# EAGLE board BEP32_12nutzen (EAGLE 6.4), part 1 of 8
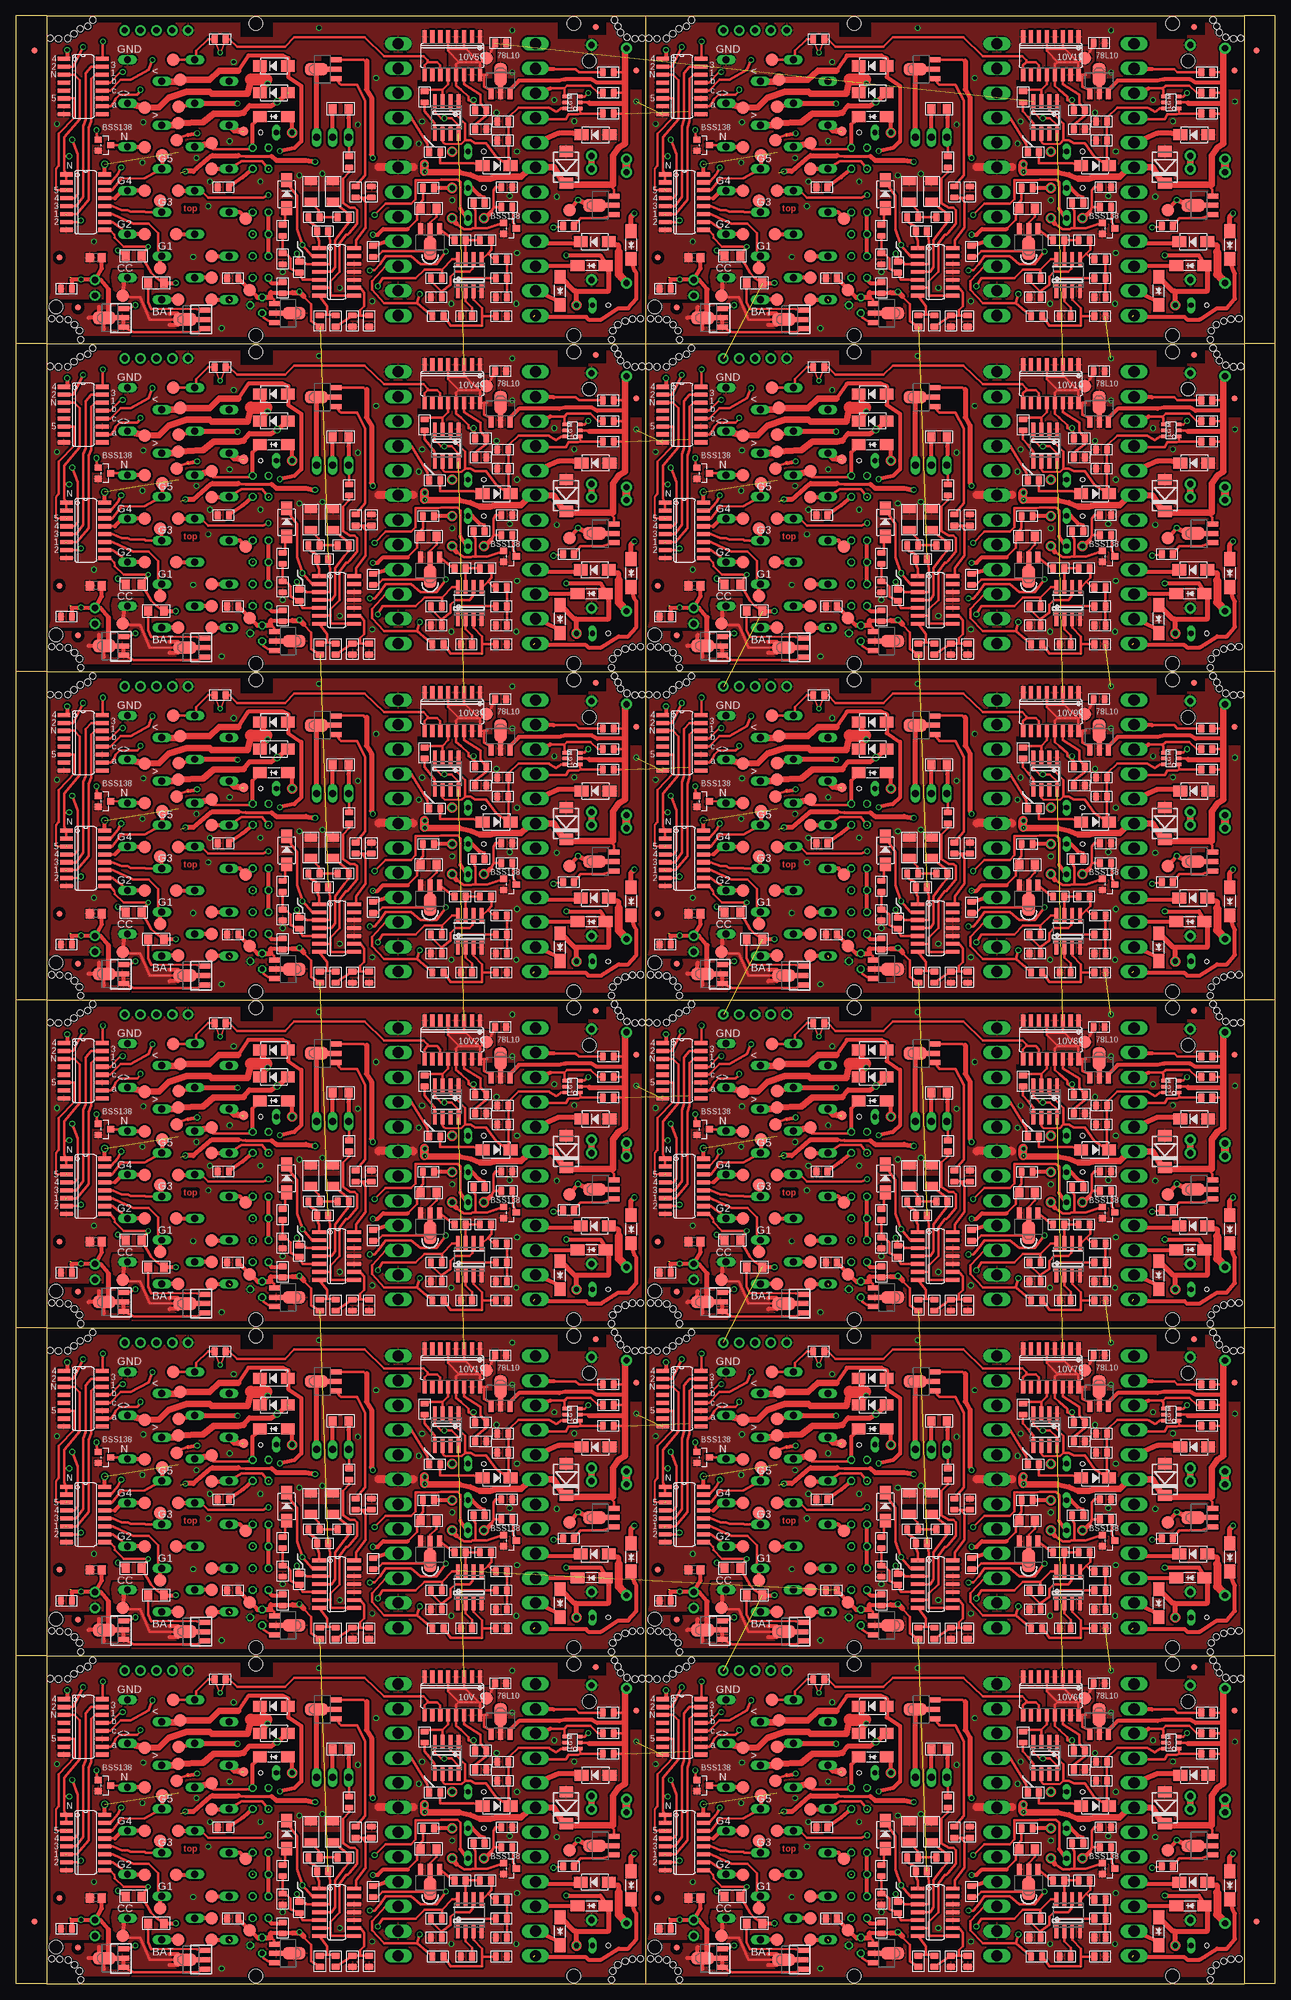
[diagram p24: board, top side]
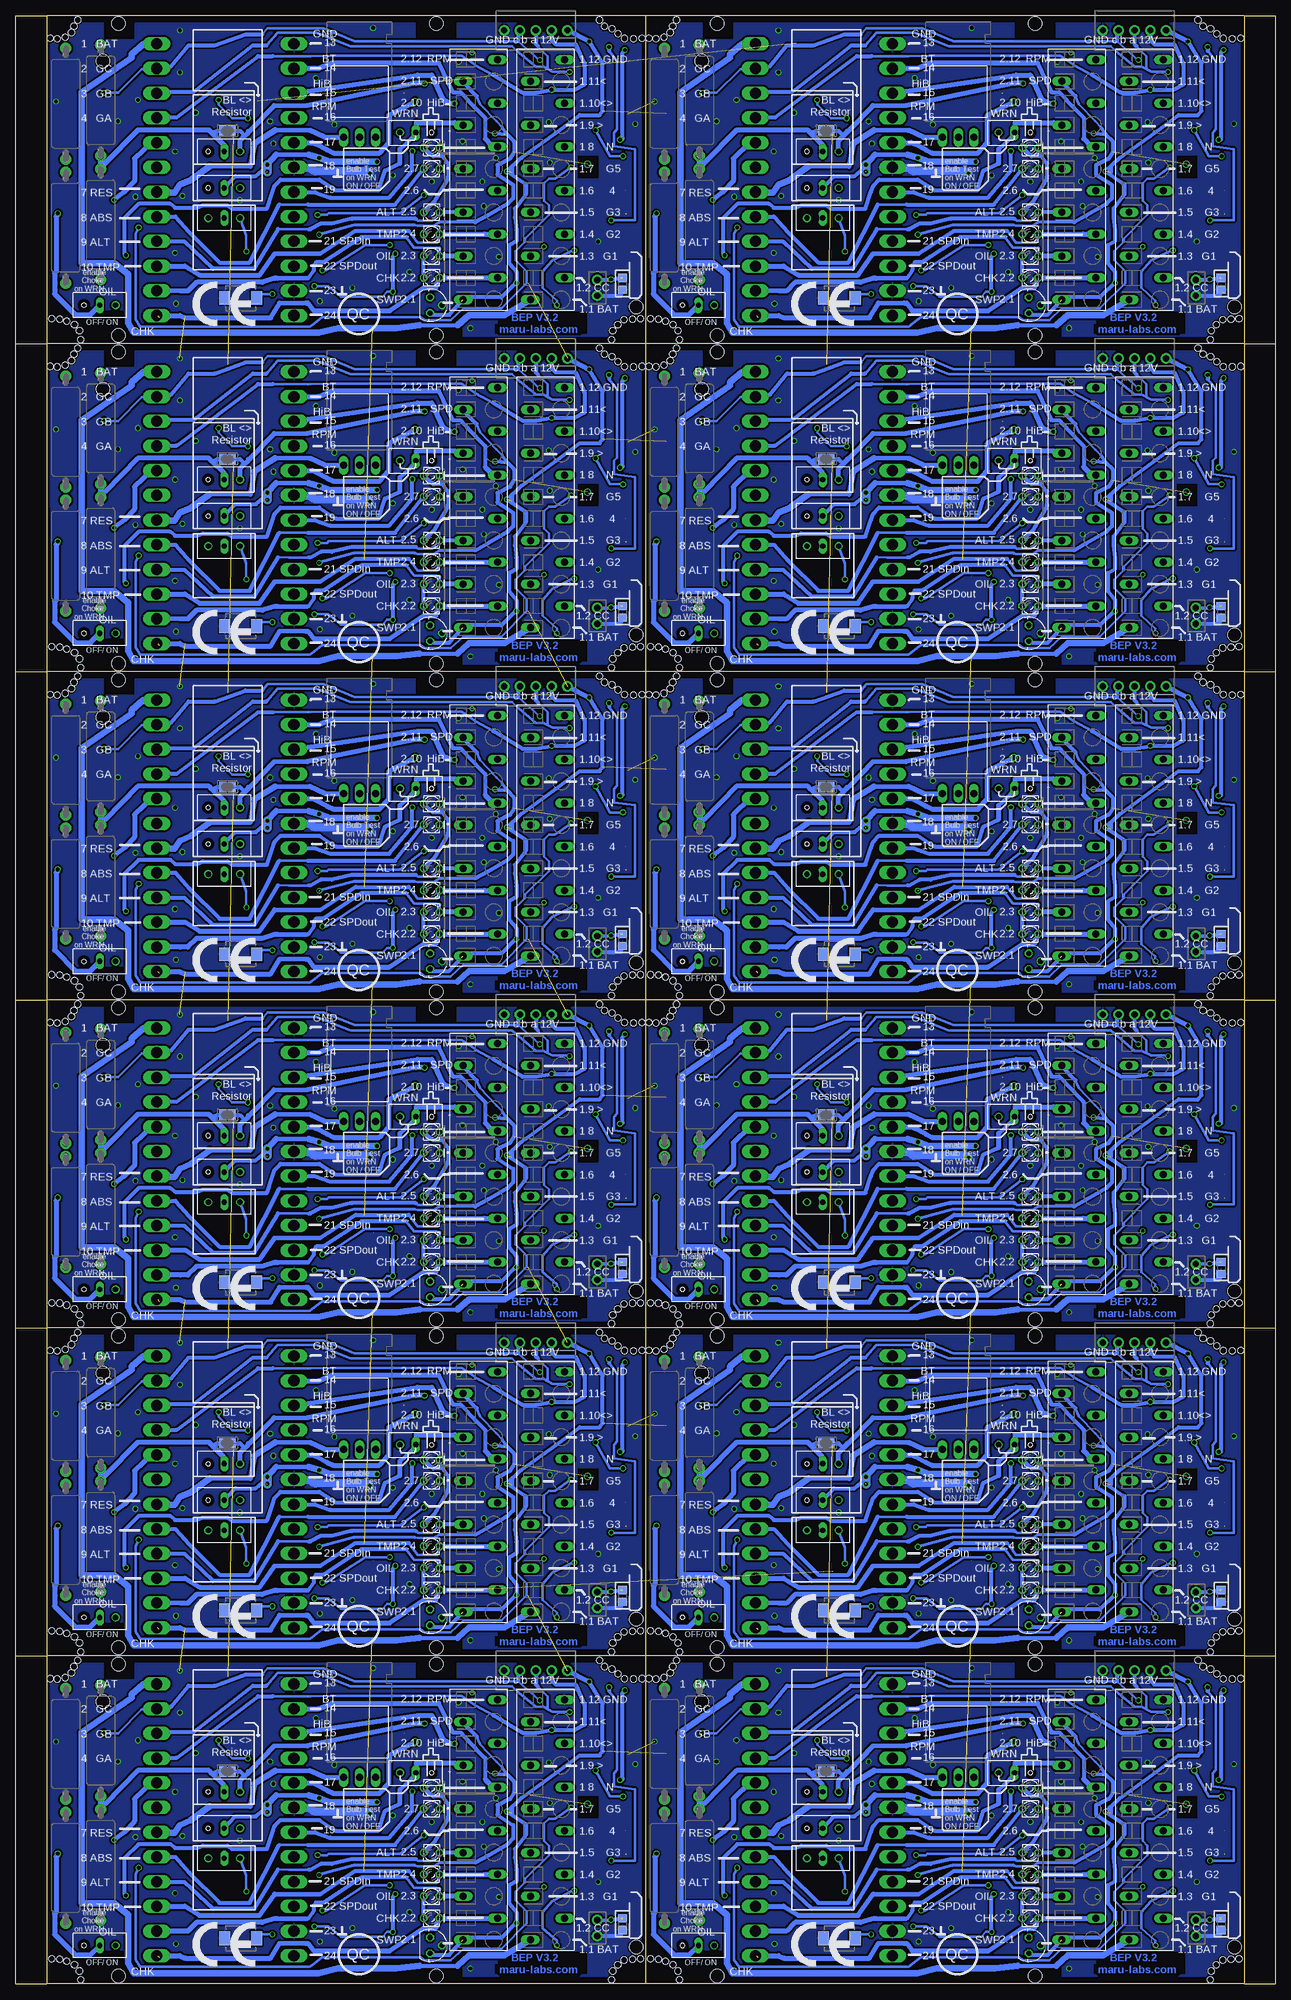
[diagram p25: board, bottom side, seen from below]

Size 202 x 315.6 mm. Coordinates in mm from the lower left corner, seen from the top.
Outline: 58 segments
Copper layers (1*16): Top 0.035mm / dielectric 1.5mm / Bottom 0.035mm
Design rules "multi-cb_035um-cu *": minimum track width 6mil, minimum drill 12mil, track to track 12mil, track to pad 12mil, pad to pad 6mil, via to via 6mil, smd to smd 6mil, copper to edge 10mil, drill to drill 8mil, minimum pad ring 8mil, minimum via ring 6mil, stop-mask expansion 3mil, vias tented up to drill 0mil, thermal gap 8mil
Holes 1.02 mm at 5.81,4.01 7.08,3.94 8.43,3.83 9.43,3.05 10.24,2.07 100.45,48.96 99.31,48.87 98.04,49.13 97.03,49.89 100.19,4.01 98.92,3.94 97.77,3.63 96.57,3.05 95.76,2.07 5.55,48.96 6.89,48.87 8.36,48.93 9.37,49.69 96.63,50.89 96.03,51.89 10.37,50.49 11.57,50.89 12.37,51.89 10.44,0.67 95.56,0.67 5.81,56.61 7.08,56.54 8.43,56.43 9.43,55.65 10.24,54.67 100.45,101.56 99.31,101.47 98.04,101.73 97.03,102.49 100.19,56.61 98.92,56.54 97.77,56.23 96.57,55.65 95.76,54.67 5.55,101.56 6.89,101.47 8.36,101.53 9.37,102.29 96.63,103.49 96.03,104.49 10.37,103.09 11.57,103.49 12.37,104.49 10.44,53.27 95.56,53.27 5.81,109.21 7.08,109.14 8.43,109.03 9.43,108.25 10.24,107.27 100.45,154.16 99.31,154.07 98.04,154.33 97.03,155.09 100.19,109.21 98.92,109.14 97.77,108.83 96.57,108.25 95.76,107.27 5.55,154.16 6.89,154.07 8.36,154.13 9.37,154.89 96.63,156.09 96.03,157.09 10.37,155.69 11.57,156.09 12.37,157.09 10.44,105.87 95.56,105.87 5.81,161.81 7.08,161.74 8.43,161.63 9.43,160.85 10.24,159.87 100.45,206.76 99.31,206.67 98.04,206.93 97.03,207.69 100.19,161.81 98.92,161.74 97.77,161.43 96.57,160.85 95.76,159.87 5.55,206.76 6.89,206.67 8.36,206.73 9.37,207.49 96.63,208.69 96.03,209.69 10.37,208.29 11.57,208.69 12.37,209.69 10.44,158.47 95.56,158.47 5.81,214.41 7.08,214.34 8.43,214.23 9.43,213.45 10.24,212.47 100.45,259.36 99.31,259.27 98.04,259.53 97.03,260.29 100.19,214.41 98.92,214.34 97.77,214.03 96.57,213.45 95.76,212.47 5.55,259.36 6.89,259.27 8.36,259.33 9.37,260.09 96.63,261.29 96.03,262.29 10.37,260.89 11.57,261.29 12.37,262.29 10.44,211.07 95.56,211.07 5.81,267.01 7.08,266.94 8.43,266.83 9.43,266.05 10.24,265.07 100.45,311.96 99.31,311.87 98.04,312.13 97.03,312.89 100.19,267.01 98.92,266.94 97.77,266.63 96.57,266.05 95.76,265.07 5.55,311.96 6.89,311.87 8.36,311.93 9.37,312.69 96.63,313.89 96.03,314.89 10.37,313.49 11.57,313.89 12.37,314.89 10.44,263.67 95.56,263.67 101.81,4.01 103.08,3.94 104.43,3.83 105.43,3.05 106.24,2.07 196.45,48.96 195.31,48.87 194.04,49.13 193.03,49.89 196.19,4.01 194.92,3.94 193.77,3.63 192.57,3.05 191.76,2.07 101.55,48.96 102.89,48.87 104.36,48.93 105.37,49.69 192.63,50.89 192.03,51.89 106.37,50.49 107.57,50.89 108.37,51.89 106.44,0.67 191.56,0.67 101.81,56.61 103.08,56.54 104.43,56.43 105.43,55.65 106.24,54.67 196.45,101.56 195.31,101.47 194.04,101.73 193.03,102.49 196.19,56.61 194.92,56.54 193.77,56.23 192.57,55.65 191.76,54.67 101.55,101.56 102.89,101.47 104.36,101.53 105.37,102.29 192.63,103.49 192.03,104.49 106.37,103.09 107.57,103.49 108.37,104.49 106.44,53.27 191.56,53.27 101.81,109.21 103.08,109.14 104.43,109.03 105.43,108.25 106.24,107.27 196.45,154.16 195.31,154.07 194.04,154.33 193.03,155.09 196.19,109.21 194.92,109.14 193.77,108.83 192.57,108.25 191.76,107.27 101.55,154.16 102.89,154.07 104.36,154.13 105.37,154.89 192.63,156.09 192.03,157.09 106.37,155.69 107.57,156.09 108.37,157.09 106.44,105.87 191.56,105.87 101.81,161.81 103.08,161.74 104.43,161.63 105.43,160.85 106.24,159.87 196.45,206.76 195.31,206.67 194.04,206.93 193.03,207.69 196.19,161.81 194.92,161.74 193.77,161.43 192.57,160.85 191.76,159.87 101.55,206.76 102.89,206.67 104.36,206.73 105.37,207.49 192.63,208.69 192.03,209.69 106.37,208.29 107.57,208.69 108.37,209.69 106.44,158.47 191.56,158.47 101.81,214.41 103.08,214.34 104.43,214.23 105.43,213.45 106.24,212.47 196.45,259.36 195.31,259.27 194.04,259.53 193.03,260.29 196.19,214.41 194.92,214.34 193.77,214.03 192.57,213.45 191.76,212.47 101.55,259.36 102.89,259.27 104.36,259.33 105.37,260.09 192.63,261.29 192.03,262.29 106.37,260.89 107.57,261.29 108.37,262.29 106.44,211.07 191.56,211.07 101.81,267.01 103.08,266.94 104.43,266.83 105.43,266.05 106.24,265.07 196.45,311.96 195.31,311.87 194.04,312.13 193.03,312.89 196.19,267.01 194.92,266.94 193.77,266.63 192.57,266.05 191.76,265.07 101.55,311.96 102.89,311.87 104.36,311.93 105.37,312.69 192.63,313.89 192.03,314.89 106.37,313.49 107.57,313.89 108.37,314.89 106.44,263.67 191.56,263.67
Holes 2.18 mm at 6.5,5.9 92,45.3 6.5,58.5 92,97.9 6.5,111.1 92,150.5 6.5,163.7 92,203.1 6.5,216.3 92,255.7 6.5,268.9 92,308.3 102.5,5.9 188,45.3 102.5,58.5 188,97.9 102.5,111.1 188,150.5 102.5,163.7 188,203.1 102.5,216.3 188,255.7 102.5,268.9 188,308.3
Holes 2.2 mm at 89.5,1.3 38.5,1.3 38.5,51.3 89.5,51.3 89.5,53.9 38.5,53.9 38.5,103.9 89.5,103.9 89.5,106.5 38.5,106.5 38.5,156.5 89.5,156.5 89.5,159.1 38.5,159.1 38.5,209.1 89.5,209.1 89.5,211.7 38.5,211.7 38.5,261.7 89.5,261.7 89.5,264.3 38.5,264.3 38.5,314.3 89.5,314.3 185.5,1.3 134.5,1.3 134.5,51.3 185.5,51.3 185.5,53.9 134.5,53.9 134.5,103.9 185.5,103.9 185.5,106.5 134.5,106.5 134.5,156.5 185.5,156.5 185.5,159.1 134.5,159.1 134.5,209.1 185.5,209.1 185.5,211.7 134.5,211.7 134.5,261.7 185.5,261.7 185.5,264.3 134.5,264.3 134.5,314.3 185.5,314.3
tRestrict: area 46,21 to 52.5,24.3; area 31.8,46 to 33.7,47.3; area 63.4,16.6 to 65.2,18.6; area 49.1,41.9 to 50.5,46.2; area 42.3,2.7 to 43.6,7.2; area 43.6,5.9 to 46.3,7.1; area 15,2.4 to 16.4,5.9; area 75.3,41.2 to 80,42.5; area 93.4,22.4 to 95,23.6; area 86.1,38 to 87.2,38.2; area 98.5,40.8 to 100.4,43; area 91.4,49.5 to 94.7,52.2; 168 more areas
bRestrict: area 14.4,1.6 to 24.6,5.1; area 24.5,1.6 to 29.1,3.1; area 34.3,0.9 to 40.8,3.1; area 35.3,49.1 to 41.8,51.5; area 86.6,1.5 to 92.6,5.3; area 12.5,26.5 to 15.8,30.1; area 87,48.9 to 91.8,51.9; area 14.4,54.2 to 24.6,57.8; area 24.5,54.2 to 29.1,55.7; area 34.3,53.5 to 40.8,55.7; area 35.3,101.7 to 41.8,104.1; area 86.6,54.1 to 92.6,57.9; 72 more areas

## Footprints (pad centres in the part's own frame; a part is rotated, then mirrored left to right if it is on the bottom)
12-PIN = drill 1.118 long: 1 19.25,-2.45; 2 15.75,3.05; 3 12.25,-2.45; 4 8.75,3.05; 5 5.25,-2.45; 6 1.75,3.05; 7 -1.75,-2.45; 8 -5.25,3.05; 9 -8.75,-2.45; 10 -12.25,3.05; 11 -15.75,-2.45; 12 -19.25,3.05
B2.0 = smd 2 x 2: TP 0,0
C0805 = smd 1.397 x 1.016: 1 0,0.889; 2 0,-0.889
C1206 = smd 1.27 x 2.032: 1 -1.651,0; 2 1.651,0
DO214AA = smd 1.8 x 2.2: A 2.55,0; C -2.55,0
DO-214AC = smd 2.2 x 1.77: 1 -2.242,0; 2 2.242,0
DO214AA_BI = smd 1.8 x 2.2: A 2.45,0; C -2.65,0
DO-214AC_SLIM = smd 2.2 x 1.77: 1 -2.242,0; 2 2.242,0
FIDUCIAL_1MM = smd 1 x 1: 1 0,0
SO08 = smd 0.6 x 2.2: 1 -1.905,-2.6; 2 -0.635,-2.6; 3 0.635,-2.6; 4 1.905,-2.6; 5 1.905,2.6; 6 0.635,2.6; 7 -0.635,2.6; 8 -1.905,2.6
SOT89_ROUND = smd 0.8 x 1.8: 1 -1.499,-2.181; 3 1.499,-2.181 | smd 0.8 x 2.3: 2 0,-1.927 | smd 2.032 x 3.65: 2@1 0,0.94
78LXX = drill 0.813 octagon: GND 0,1.905; IN 1.27,0; OUT -1.27,0
SO16 = smd 0.66 x 2.032: 1 -4.445,-3.073; 2 -3.175,-3.073; 3 -1.905,-3.073; 4 -0.635,-3.073; 5 0.635,-3.073; 6 1.905,-3.073; 7 3.175,-3.073; 8 4.445,-3.073; 9 4.445,3.073; 10 3.175,3.073; 11 1.905,3.073; 12 0.635,3.073; 13 -0.635,3.073; 14 -1.905,3.073; 15 -3.175,3.073; 16 -4.445,3.073
SOT457R_PHILIPS = smd 0.55 x 0.8: 1 -0.95,-1.2; 2 0,-1.2; 3 0.95,-1.2; 4 0.95,1.2; 5 0,1.2; 6 -0.95,1.2
SO14 = smd 0.6 x 2.2: 1 -3.81,-2.8; 2 -2.54,-2.8; 3 -1.27,-2.8; 4 0,-2.8; 5 1.27,-2.8; 6 2.54,-2.8; 7 3.81,-2.8; 8 3.81,2.8; 9 2.54,2.8; 10 1.27,2.8; 11 0,2.8; 12 -1.27,2.8; 13 -2.54,2.8; 14 -3.81,2.8
TO220H_NOHOLE = drill 1.118 long: 1 -2.54,-10.16; 2 0,-10.16; 3 2.54,-10.16
JP2_SMALLPADS = drill 0.85: 1 -2.54,0 | drill 0.85 long: 2 0,0 | hole 0.7: 2.54,0
JP2_ORIG_SMALLPADS = drill 0.85: 1 -2.54,0; 3 2.54,0 | drill 0.85 long: 2 0,0
LD260 = drill 0.813 octagon: A -1.27,0; K 1.27,0
SOT89 = smd 0.8 x 1.8: 1 -1.499,-2.181; 3 1.499,-2.181 | smd 0.8 x 2.3: 2 0,-1.927 | smd 2.032 x 3.65: 2@1 0,0.94
SOT-23 = smd 1.016 x 1.143: 1 -0.889,-1.016; 2 0.889,-1.016; 3 0,1.016
R0805 = smd 1.397 x 1.016: 1 0,0.889; 2 0,-0.889
R1206 = smd 1.27 x 1.524: 1 -1.27,0; 2 1.27,0
R0805' = smd 1.3 x 1.5: 1 -0.95,0; 2 0.95,0
V235/17_1MM = drill 1 pad 1.778: 1 -8.89,0; 2 8.89,0
SJ = smd 1.2 x 1.6: 1 -0.725,0; 2 0.725,0
B1,27 = smd 1.5 x 1.5: TP 0,0
24-PIN_V2 = drill 1.778 long: 1 -21.78,-11; 2 -17.82,-11; 3 -13.86,-11; 4 -9.9,-11; 5 -5.94,-11; 6 -1.98,-11; 7 1.98,-11; 8 5.94,-11; 9 9.9,-11; 10 13.86,-11; 11 17.82,-11; 12 21.78,-11; 13 -21.78,11; 14 -17.82,11; 15 -13.86,11; 16 -9.9,11; 17 -5.94,11; 18 -1.98,11; 19 1.98,11; 20 5.94,11; 21 9.9,11; 22 13.86,11; 23 17.82,11; 24 21.78,11
22-23-2021 = drill 1 pad 1.676: 1 -1.27,0; 2 1.27,0
22-23-2051 = drill 1 pad 1.676: 1 -5.08,0; 2 -2.54,0; 3 0,0; 4 2.54,0; 5 5.08,0

## Placement (x,y rotation side)
1  [12-PIN]  20.99,26.3 270 bottom
2  [12-PIN]  31.79,26.3 270 bottom
3  [12-PIN]  20.99,78.9 270 bottom
4  [12-PIN]  31.79,78.9 270 bottom
5  [12-PIN]  20.99,131.5 270 bottom
6  [12-PIN]  31.79,131.5 270 bottom
6V  TPSB2.0  [B2.0]  37.5,8.58 0 top
6V1  TPSB2.0  [B2.0]  37.5,61.18 0 top
6V2  TPSB2.0  [B2.0]  37.5,113.78 0 top
6V3  TPSB2.0  [B2.0]  37.5,166.38 0 top
6V4  TPSB2.0  [B2.0]  37.5,218.98 0 top
6V5  TPSB2.0  [B2.0]  37.5,271.58 0 top
6V6  TPSB2.0  [B2.0]  133.5,8.58 0 top
6V7  TPSB2.0  [B2.0]  133.5,61.18 0 top
6V8  TPSB2.0  [B2.0]  133.5,113.78 0 top
6V9  TPSB2.0  [B2.0]  133.5,166.38 0 top
6V10  TPSB2.0  [B2.0]  133.5,218.98 0 top
6V11  TPSB2.0  [B2.0]  133.5,271.58 0 top
7  [12-PIN]  20.99,184.1 270 bottom
8  [12-PIN]  31.79,184.1 270 bottom
9  [12-PIN]  20.99,236.7 270 bottom
10  [12-PIN]  31.79,236.7 270 bottom
10V  TPSB2.0  [B2.0]  75.5,45.8 0 top
10V1  TPSB2.0  [B2.0]  75.5,98.4 0 top
10V2  TPSB2.0  [B2.0]  75.5,151 0 top
10V3  TPSB2.0  [B2.0]  75.5,203.6 0 top
10V4  TPSB2.0  [B2.0]  75.5,256.2 0 top
10V5  TPSB2.0  [B2.0]  75.5,308.8 0 top
10V6  TPSB2.0  [B2.0]  171.5,45.8 0 top
10V7  TPSB2.0  [B2.0]  171.5,98.4 0 top
10V8  TPSB2.0  [B2.0]  171.5,151 0 top
10V9  TPSB2.0  [B2.0]  171.5,203.6 0 top
10V10  TPSB2.0  [B2.0]  171.5,256.2 0 top
10V11  TPSB2.0  [B2.0]  171.5,308.8 0 top
11  [12-PIN]  20.99,289.3 270 bottom
12  [12-PIN]  31.79,289.3 270 bottom
13  [12-PIN]  116.99,26.3 270 bottom
14  [12-PIN]  127.78,26.3 270 bottom
15  [12-PIN]  116.99,78.9 270 bottom
16  [12-PIN]  127.78,78.9 270 bottom
17  [12-PIN]  116.99,131.5 270 bottom
18  [12-PIN]  127.78,131.5 270 bottom
19  [12-PIN]  116.99,184.1 270 bottom
20  [12-PIN]  127.78,184.1 270 bottom
21  [12-PIN]  116.99,236.7 270 bottom
22  [12-PIN]  127.78,236.7 270 bottom
23  [12-PIN]  116.99,289.3 270 bottom
24  [12-PIN]  127.78,289.3 270 bottom
C1  4.7u  [C0805]  77.89,4.39 90 top
C2  100nF  [C0805]  77.76,48.2 90 top
C3  100nF,  [C0805]  77.89,7.44 270 top
C4  100nF,  [C0805]  34.83,10.48 270 top
C5  100nF.  [C0805]  54.01,3.63 0 top
C6  100nF.  [C0805]  57.06,24.33 0 top
C7  100u  [C1206]  47.34,24.39 90 top
C8  100u  [C1206]  50.9,24.39 90 top
C9  2.2nF  [C0805]  78.14,32.58 90 top
C10  100nF  [C0805]  74.58,34.36 90 top
C11  100u  [C1206]  47.34,76.99 90 top
C12  100u  [C1206]  50.9,76.99 90 top
C13  100nF,  [C0805]  34.83,63.08 270 top
C14  4.7u  [C0805]  77.89,56.99 90 top
C15  100nF.  [C0805]  54.01,56.23 0 top
C16  100nF.  [C0805]  57.06,76.93 0 top
C17  2.2nF  [C0805]  78.14,85.18 90 top
C18  100nF  [C0805]  77.76,100.8 90 top
C19  100nF  [C0805]  74.58,86.96 90 top
C20  100nF,  [C0805]  77.89,60.04 270 top
C21  100u  [C1206]  47.34,129.59 90 top
C22  100u  [C1206]  50.9,129.59 90 top
C23  100nF,  [C0805]  34.83,115.68 270 top
C24  4.7u  [C0805]  77.89,109.59 90 top
C25  100nF.  [C0805]  54.01,108.83 0 top
C26  100nF.  [C0805]  57.06,129.53 0 top
C27  2.2nF  [C0805]  78.14,137.78 90 top
C28  100nF  [C0805]  77.76,153.4 90 top
C29  100nF  [C0805]  74.58,139.56 90 top
C30  100nF,  [C0805]  77.89,112.64 270 top
C31  100u  [C1206]  47.34,182.19 90 top
C32  100u  [C1206]  50.9,182.19 90 top
C33  100nF,  [C0805]  34.83,168.28 270 top
C34  4.7u  [C0805]  77.89,162.19 90 top
C35  100nF.  [C0805]  54.01,161.43 0 top
C36  100nF.  [C0805]  57.06,182.13 0 top
C37  2.2nF  [C0805]  78.14,190.38 90 top
C38  100nF  [C0805]  77.76,206 90 top
C39  100nF  [C0805]  74.58,192.16 90 top
C40  100nF,  [C0805]  77.89,165.24 270 top
C41  100u  [C1206]  47.34,234.79 90 top
C42  100u  [C1206]  50.9,234.79 90 top
C43  100nF,  [C0805]  34.83,220.88 270 top
C44  4.7u  [C0805]  77.89,214.79 90 top
C45  100nF.  [C0805]  54.01,214.03 0 top
C46  100nF.  [C0805]  57.06,234.73 0 top
C47  2.2nF  [C0805]  78.14,242.98 90 top
C48  100nF  [C0805]  77.76,258.6 90 top
C49  100nF  [C0805]  74.58,244.76 90 top
C50  100nF,  [C0805]  77.89,217.84 270 top
C51  100u  [C1206]  47.34,287.39 90 top
C52  100u  [C1206]  50.9,287.39 90 top
C53  100nF,  [C0805]  34.83,273.48 270 top
C54  4.7u  [C0805]  77.89,267.39 90 top
C55  100nF.  [C0805]  54.01,266.63 0 top
C56  100nF.  [C0805]  57.06,287.33 0 top
C57  2.2nF  [C0805]  78.14,295.58 90 top
C58  100nF  [C0805]  77.76,311.2 90 top
C59  100nF  [C0805]  74.58,297.36 90 top
C60  100nF,  [C0805]  77.89,270.44 270 top
C61  100u  [C1206]  143.34,24.39 90 top
C62  100u  [C1206]  146.9,24.39 90 top
C63  100nF,  [C0805]  130.83,10.48 270 top
C64  4.7u  [C0805]  173.89,4.39 90 top
C65  100nF.  [C0805]  150.01,3.63 0 top
C66  100nF.  [C0805]  153.06,24.33 0 top
C67  2.2nF  [C0805]  174.14,32.58 90 top
C68  100nF  [C0805]  173.76,48.2 90 top
C69  100nF  [C0805]  170.58,34.36 90 top
C70  100nF,  [C0805]  173.89,7.44 270 top
C71  100u  [C1206]  143.34,76.99 90 top
C72  100u  [C1206]  146.9,76.99 90 top
C73  100nF,  [C0805]  130.83,63.08 270 top
C74  4.7u  [C0805]  173.89,56.99 90 top
C75  100nF.  [C0805]  150.01,56.23 0 top
C76  100nF.  [C0805]  153.06,76.93 0 top
C77  2.2nF  [C0805]  174.14,85.18 90 top
C78  100nF  [C0805]  173.76,100.8 90 top
C79  100nF  [C0805]  170.58,86.96 90 top
C80  100nF,  [C0805]  173.89,60.04 270 top
C81  100u  [C1206]  143.34,129.59 90 top
C82  100u  [C1206]  146.9,129.59 90 top
C83  100nF,  [C0805]  130.83,115.68 270 top
C84  4.7u  [C0805]  173.89,109.59 90 top
C85  100nF.  [C0805]  150.01,108.83 0 top
C86  100nF.  [C0805]  153.06,129.53 0 top
C87  2.2nF  [C0805]  174.14,137.78 90 top
C88  100nF  [C0805]  173.76,153.4 90 top
C89  100nF  [C0805]  170.58,139.56 90 top
C90  100nF,  [C0805]  173.89,112.64 270 top
C91  100u  [C1206]  143.34,182.19 90 top
C92  100u  [C1206]  146.9,182.19 90 top
C93  100nF,  [C0805]  130.83,168.28 270 top
C94  4.7u  [C0805]  173.89,162.19 90 top
C95  100nF.  [C0805]  150.01,161.43 0 top
C96  100nF.  [C0805]  153.06,182.13 0 top
C97  2.2nF  [C0805]  174.14,190.38 90 top
C98  100nF  [C0805]  173.76,206 90 top
C99  100nF  [C0805]  170.58,192.16 90 top
C100  100nF,  [C0805]  173.89,165.24 270 top
C101  100u  [C1206]  143.34,234.79 90 top
C102  100u  [C1206]  146.9,234.79 90 top
C103  100nF,  [C0805]  130.83,220.88 270 top
C104  4.7u  [C0805]  173.89,214.79 90 top
C105  100nF.  [C0805]  150.01,214.03 0 top
C106  100nF.  [C0805]  153.06,234.73 0 top
C107  2.2nF  [C0805]  174.14,242.98 90 top
C108  100nF  [C0805]  173.76,258.6 90 top
C109  100nF  [C0805]  170.58,244.76 90 top
C110  100nF,  [C0805]  173.89,217.84 270 top
C111  100u  [C1206]  143.34,287.39 90 top
C112  100u  [C1206]  146.9,287.39 90 top
C113  100nF,  [C0805]  130.83,273.48 270 top
C114  4.7u  [C0805]  173.89,267.39 90 top
C115  100nF.  [C0805]  150.01,266.63 0 top
C116  100nF.  [C0805]  153.06,287.33 0 top
C117  2.2nF  [C0805]  174.14,295.58 90 top
C118  100nF  [C0805]  173.76,311.2 90 top
C119  100nF  [C0805]  170.58,297.36 90 top
C120  100nF,  [C0805]  173.89,270.44 270 top
D1  SM6T  [DO214AA]  88.3,28.26 90 top
D2  1N4007,  [DO-214AC]  41.44,40.2 180 top
D3  1N4007,  [DO-214AC]  41.44,44.52 180 top
D4  SM6TDO214AA_BI  [DO214AA_BI]  70.01,7.31 180 bottom
D5  1N4007.  [DO-214AC]  93,33.47 180 top
D6  1N4007.  [DO-214AC]  92.87,16.33 180 top
D7  1N5817  [DO-214AC_SLIM]  92.36,12.52 180 top
D8  1N5817.  [DO-214AC_SLIM]  87.3,8.44 270 top
D9  1N5817.  [DO-214AC_SLIM]  98.73,15.81 270 top
D10  1N5817  [DO-214AC_SLIM]  41.44,36.39 180 top
D11  1N4007  [DO-214AC]  43.47,23.95 90 top
D12  1N4007  [DO-214AC]  77.12,28.52 0 top
D13  1N4007  [DO-214AC]  43.47,76.55 90 top
D14  1N4007,  [DO-214AC]  41.44,92.8 180 top
D15  1N4007,  [DO-214AC]  41.44,97.12 180 top
D16  1N4007.  [DO-214AC]  92.87,68.93 180 top
D17  1N5817  [DO-214AC_SLIM]  92.36,65.12 180 top
D18  1N5817.  [DO-214AC_SLIM]  87.3,61.04 270 top
D19  1N5817.  [DO-214AC_SLIM]  98.73,68.41 270 top
D20  1N5817  [DO-214AC_SLIM]  41.44,88.99 180 top
D21  1N4007.  [DO-214AC]  93,86.07 180 top
D22  1N4007  [DO-214AC]  77.12,81.12 0 top
D23  SM6T  [DO214AA]  88.3,80.86 90 top
D24  SM6TDO214AA_BI  [DO214AA_BI]  70.01,59.91 180 bottom
D25  1N4007  [DO-214AC]  43.47,129.15 90 top
D26  1N4007,  [DO-214AC]  41.44,145.4 180 top
D27  1N4007,  [DO-214AC]  41.44,149.72 180 top
D28  1N4007.  [DO-214AC]  92.87,121.53 180 top
D29  1N5817  [DO-214AC_SLIM]  92.36,117.72 180 top
D30  1N5817.  [DO-214AC_SLIM]  87.3,113.64 270 top
D31  1N5817.  [DO-214AC_SLIM]  98.73,121.01 270 top
D32  1N5817  [DO-214AC_SLIM]  41.44,141.59 180 top
D33  1N4007.  [DO-214AC]  93,138.67 180 top
D34  1N4007  [DO-214AC]  77.12,133.72 0 top
D35  SM6T  [DO214AA]  88.3,133.46 90 top
D36  SM6TDO214AA_BI  [DO214AA_BI]  70.01,112.51 180 bottom
D37  1N4007  [DO-214AC]  43.47,181.75 90 top
D38  1N4007,  [DO-214AC]  41.44,198 180 top
D39  1N4007,  [DO-214AC]  41.44,202.32 180 top
D40  1N4007.  [DO-214AC]  92.87,174.13 180 top
D41  1N5817  [DO-214AC_SLIM]  92.36,170.32 180 top
D42  1N5817.  [DO-214AC_SLIM]  87.3,166.24 270 top
D43  1N5817.  [DO-214AC_SLIM]  98.73,173.61 270 top
D44  1N5817  [DO-214AC_SLIM]  41.44,194.19 180 top
D45  1N4007.  [DO-214AC]  93,191.27 180 top
D46  1N4007  [DO-214AC]  77.12,186.32 0 top
D47  SM6T  [DO214AA]  88.3,186.06 90 top
D48  SM6TDO214AA_BI  [DO214AA_BI]  70.01,165.11 180 bottom
D49  1N4007  [DO-214AC]  43.47,234.35 90 top
D50  1N4007,  [DO-214AC]  41.44,250.6 180 top
D51  1N4007,  [DO-214AC]  41.44,254.92 180 top
D52  1N4007.  [DO-214AC]  92.87,226.73 180 top
D53  1N5817  [DO-214AC_SLIM]  92.36,222.92 180 top
D54  1N5817.  [DO-214AC_SLIM]  87.3,218.84 270 top
D55  1N5817.  [DO-214AC_SLIM]  98.73,226.21 270 top
D56  1N5817  [DO-214AC_SLIM]  41.44,246.79 180 top
D57  1N4007.  [DO-214AC]  93,243.87 180 top
D58  1N4007  [DO-214AC]  77.12,238.92 0 top
D59  SM6T  [DO214AA]  88.3,238.66 90 top
D60  SM6TDO214AA_BI  [DO214AA_BI]  70.01,217.71 180 bottom
D61  1N4007  [DO-214AC]  43.47,286.95 90 top
D62  1N4007,  [DO-214AC]  41.44,303.2 180 top
D63  1N4007,  [DO-214AC]  41.44,307.52 180 top
D64  1N4007.  [DO-214AC]  92.87,279.33 180 top
D65  1N5817  [DO-214AC_SLIM]  92.36,275.52 180 top
D66  1N5817.  [DO-214AC_SLIM]  87.3,271.44 270 top
D67  1N5817.  [DO-214AC_SLIM]  98.73,278.81 270 top
D68  1N5817  [DO-214AC_SLIM]  41.44,299.39 180 top
D69  1N4007.  [DO-214AC]  93,296.47 180 top
D70  1N4007  [DO-214AC]  77.12,291.52 0 top
D71  SM6T  [DO214AA]  88.3,291.26 90 top
D72  SM6TDO214AA_BI  [DO214AA_BI]  70.01,270.31 180 bottom
D73  1N4007  [DO-214AC]  139.47,23.95 90 top
D74  1N4007,  [DO-214AC]  137.44,40.2 180 top
D75  1N4007,  [DO-214AC]  137.44,44.52 180 top
D76  1N4007.  [DO-214AC]  188.87,16.33 180 top
D77  1N5817  [DO-214AC_SLIM]  188.36,12.52 180 top
D78  1N5817.  [DO-214AC_SLIM]  183.3,8.44 270 top
D79  1N5817.  [DO-214AC_SLIM]  194.73,15.81 270 top
D80  1N5817  [DO-214AC_SLIM]  137.44,36.39 180 top
D81  1N4007.  [DO-214AC]  189,33.47 180 top
D82  1N4007  [DO-214AC]  173.12,28.52 0 top
D83  SM6T  [DO214AA]  184.3,28.26 90 top
D84  SM6TDO214AA_BI  [DO214AA_BI]  166.01,7.31 180 bottom
D85  1N4007  [DO-214AC]  139.47,76.55 90 top
D86  1N4007,  [DO-214AC]  137.44,92.8 180 top
D87  1N4007,  [DO-214AC]  137.44,97.12 180 top
D88  1N4007.  [DO-214AC]  188.87,68.93 180 top
D89  1N5817  [DO-214AC_SLIM]  188.36,65.12 180 top
D90  1N5817.  [DO-214AC_SLIM]  183.3,61.04 270 top
D91  1N5817.  [DO-214AC_SLIM]  194.73,68.41 270 top
D92  1N5817  [DO-214AC_SLIM]  137.44,88.99 180 top
D93  1N4007.  [DO-214AC]  189,86.07 180 top
D94  1N4007  [DO-214AC]  173.12,81.12 0 top
D95  SM6T  [DO214AA]  184.3,80.86 90 top
D96  SM6TDO214AA_BI  [DO214AA_BI]  166.01,59.91 180 bottom
D97  1N4007  [DO-214AC]  139.47,129.15 90 top
D98  1N4007,  [DO-214AC]  137.44,145.4 180 top
D99  1N4007,  [DO-214AC]  137.44,149.72 180 top
D100  1N4007.  [DO-214AC]  188.87,121.53 180 top
D101  1N5817  [DO-214AC_SLIM]  188.36,117.72 180 top
D102  1N5817.  [DO-214AC_SLIM]  183.3,113.64 270 top
D103  1N5817.  [DO-214AC_SLIM]  194.73,121.01 270 top
D104  1N5817  [DO-214AC_SLIM]  137.44,141.59 180 top
D105  1N4007.  [DO-214AC]  189,138.67 180 top
D106  1N4007  [DO-214AC]  173.12,133.72 0 top
D107  SM6T  [DO214AA]  184.3,133.46 90 top
D108  SM6TDO214AA_BI  [DO214AA_BI]  166.01,112.51 180 bottom
D109  1N4007  [DO-214AC]  139.47,181.75 90 top
D110  1N4007,  [DO-214AC]  137.44,198 180 top
D111  1N4007,  [DO-214AC]  137.44,202.32 180 top
D112  1N4007.  [DO-214AC]  188.87,174.13 180 top
D113  1N5817  [DO-214AC_SLIM]  188.36,170.32 180 top
D114  1N5817.  [DO-214AC_SLIM]  183.3,166.24 270 top
D115  1N5817.  [DO-214AC_SLIM]  194.73,173.61 270 top
D116  1N5817  [DO-214AC_SLIM]  137.44,194.19 180 top
D117  1N4007.  [DO-214AC]  189,191.27 180 top
D118  1N4007  [DO-214AC]  173.12,186.32 0 top
D119  SM6T  [DO214AA]  184.3,186.06 90 top
D120  SM6TDO214AA_BI  [DO214AA_BI]  166.01,165.11 180 bottom
D121  1N4007  [DO-214AC]  139.47,234.35 90 top
D122  1N4007,  [DO-214AC]  137.44,250.6 180 top
D123  1N4007,  [DO-214AC]  137.44,254.92 180 top
D124  1N4007.  [DO-214AC]  188.87,226.73 180 top
D125  1N5817  [DO-214AC_SLIM]  188.36,222.92 180 top
D126  1N5817.  [DO-214AC_SLIM]  183.3,218.84 270 top
D127  1N5817.  [DO-214AC_SLIM]  194.73,226.21 270 top
D128  1N5817  [DO-214AC_SLIM]  137.44,246.79 180 top
D129  1N4007.  [DO-214AC]  189,243.87 180 top
D130  1N4007  [DO-214AC]  173.12,238.92 0 top
D131  SM6T  [DO214AA]  184.3,238.66 90 top
D132  SM6TDO214AA_BI  [DO214AA_BI]  166.01,217.71 180 bottom
D133  1N4007  [DO-214AC]  139.47,286.95 90 top
D134  1N4007,  [DO-214AC]  137.44,303.2 180 top
D135  1N4007,  [DO-214AC]  137.44,307.52 180 top
D136  1N4007.  [DO-214AC]  188.87,279.33 180 top
D137  1N5817  [DO-214AC_SLIM]  188.36,275.52 180 top
D138  1N5817.  [DO-214AC_SLIM]  183.3,271.44 270 top
D139  1N5817.  [DO-214AC_SLIM]  194.73,278.81 270 top
D140  1N5817  [DO-214AC_SLIM]  137.44,299.39 180 top
D141  1N4007.  [DO-214AC]  189,296.47 180 top
D142  1N4007  [DO-214AC]  173.12,291.52 0 top
D143  SM6T  [DO214AA]  184.3,291.26 90 top
D144  SM6TDO214AA_BI  [DO214AA_BI]  166.01,270.31 180 bottom
FID1  FIDUCIAL  [FIDUCIAL_1MM]  93,50.8 0 top
FID2  FIDUCIAL  [FIDUCIAL_1MM]  7,13.8 0 top
FID3  FIDUCIAL  [FIDUCIAL_1MM]  10,5.8 0 top
FID4  FIDUCIAL  [FIDUCIAL_1MM]  99.5,43.8 0 top
FID5  FIDUCIAL  [FIDUCIAL_1MM]  93,103.4 0 top
FID6  FIDUCIAL  [FIDUCIAL_1MM]  7,66.4 0 top
FID7  FIDUCIAL  [FIDUCIAL_1MM]  10,58.4 0 top
FID8  FIDUCIAL  [FIDUCIAL_1MM]  99.5,96.4 0 top
FID9  FIDUCIAL  [FIDUCIAL_1MM]  93,156 0 top
FID10  FIDUCIAL  [FIDUCIAL_1MM]  7,119 0 top
FID11  FIDUCIAL  [FIDUCIAL_1MM]  10,111 0 top
FID12  FIDUCIAL  [FIDUCIAL_1MM]  99.5,149 0 top
FID13  FIDUCIAL  [FIDUCIAL_1MM]  93,208.6 0 top
FID14  FIDUCIAL  [FIDUCIAL_1MM]  7,171.6 0 top
FID15  FIDUCIAL  [FIDUCIAL_1MM]  10,163.6 0 top
FID16  FIDUCIAL  [FIDUCIAL_1MM]  99.5,201.6 0 top
FID17  FIDUCIAL  [FIDUCIAL_1MM]  93,261.2 0 top
FID18  FIDUCIAL  [FIDUCIAL_1MM]  7,224.2 0 top
FID19  FIDUCIAL  [FIDUCIAL_1MM]  10,216.2 0 top
FID20  FIDUCIAL  [FIDUCIAL_1MM]  99.5,254.2 0 top
FID21  FIDUCIAL  [FIDUCIAL_1MM]  93,313.8 0 top
FID22  FIDUCIAL  [FIDUCIAL_1MM]  7,276.8 0 top
FID23  FIDUCIAL  [FIDUCIAL_1MM]  10,268.8 0 top
FID24  FIDUCIAL  [FIDUCIAL_1MM]  99.5,306.8 0 top
FID25  FIDUCIAL  [FIDUCIAL_1MM]  189,50.8 0 top
FID26  FIDUCIAL  [FIDUCIAL_1MM]  103,13.8 0 top
FID27  FIDUCIAL  [FIDUCIAL_1MM]  106,5.8 0 top
FID28  FIDUCIAL  [FIDUCIAL_1MM]  195.5,43.8 0 top
FID29  FIDUCIAL  [FIDUCIAL_1MM]  189,103.4 0 top
FID30  FIDUCIAL  [FIDUCIAL_1MM]  103,66.4 0 top
FID31  FIDUCIAL  [FIDUCIAL_1MM]  106,58.4 0 top
FID32  FIDUCIAL  [FIDUCIAL_1MM]  195.5,96.4 0 top
FID33  FIDUCIAL  [FIDUCIAL_1MM]  189,156 0 top
FID34  FIDUCIAL  [FIDUCIAL_1MM]  103,119 0 top
FID35  FIDUCIAL  [FIDUCIAL_1MM]  106,111 0 top
FID36  FIDUCIAL  [FIDUCIAL_1MM]  195.5,149 0 top
FID37  FIDUCIAL  [FIDUCIAL_1MM]  189,208.6 0 top
FID38  FIDUCIAL  [FIDUCIAL_1MM]  103,171.6 0 top
FID39  FIDUCIAL  [FIDUCIAL_1MM]  106,163.6 0 top
FID40  FIDUCIAL  [FIDUCIAL_1MM]  195.5,201.6 0 top
FID41  FIDUCIAL  [FIDUCIAL_1MM]  189,261.2 0 top
FID42  FIDUCIAL  [FIDUCIAL_1MM]  103,224.2 0 top
FID43  FIDUCIAL  [FIDUCIAL_1MM]  106,216.2 0 top
FID44  FIDUCIAL  [FIDUCIAL_1MM]  195.5,254.2 0 top
FID45  FIDUCIAL  [FIDUCIAL_1MM]  189,313.8 0 top
FID46  FIDUCIAL  [FIDUCIAL_1MM]  103,276.8 0 top
FID47  FIDUCIAL  [FIDUCIAL_1MM]  106,268.8 0 top
FID48  FIDUCIAL  [FIDUCIAL_1MM]  195.5,306.8 0 top
FID49  FIDUCIAL  [FIDUCIAL_1MM]  3,10 0 top
FID50  FIDUCIAL  [FIDUCIAL_1MM]  199,10 0 top
FID51  FIDUCIAL  [FIDUCIAL_1MM]  3,310 0 top
FID52  FIDUCIAL  [FIDUCIAL_1MM]  199,310 0 top
IC1  LM2904  [SO08]  72.81,10.99 0 top
IC2  78L06  [SOT89_ROUND]  43.72,4.9 270 top
IC3  6V pos  [78LXX]  39.53,6.17 270 bottom
IC4  78L10  [SOT89_ROUND]  77.76,42.23 0 top
IC5  4028  [SO16]  10.83,41.22 270 top
IC6  NUP4304SOT457_R  [SOT457R_PHILIPS]  89.32,38.68 90 top
IC7  ULN2004  [SO16]  11.23,22.68 270 top
IC8  LM339  [SO14]  51.47,11.5 270 top
IC9  317TO202H_NOHOLE  [TO220H_NOHOLE]  50.84,43.25 0 bottom
IC10  555  [SO08]  69.12,36.27 180 top
IC11  4538  [SO16]  70.01,46.17 180 top
IC12  4028  [SO16]  10.83,93.82 270 top
IC13  6V pos  [78LXX]  39.53,58.77 270 bottom
IC14  317TO202H_NOHOLE  [TO220H_NOHOLE]  50.84,95.85 0 bottom
IC15  ULN2004  [SO16]  11.23,75.28 270 top
IC16  LM339  [SO14]  51.47,64.1 270 top
IC17  78L06  [SOT89_ROUND]  43.72,57.5 270 top
IC18  555  [SO08]  69.12,88.86 180 top
IC19  4538  [SO16]  70.01,98.77 180 top
IC20  78L10  [SOT89_ROUND]  77.76,94.83 0 top
IC21  LM2904  [SO08]  72.81,63.59 0 top
IC22  NUP4304SOT457_R  [SOT457R_PHILIPS]  89.32,91.28 90 top
IC23  4028  [SO16]  10.83,146.42 270 top
IC24  6V pos  [78LXX]  39.53,111.37 270 bottom
IC25  317TO202H_NOHOLE  [TO220H_NOHOLE]  50.84,148.45 0 bottom
IC26  ULN2004  [SO16]  11.23,127.88 270 top
IC27  LM339  [SO14]  51.47,116.7 270 top
IC28  78L06  [SOT89_ROUND]  43.72,110.1 270 top
IC29  555  [SO08]  69.12,141.47 180 top
IC30  4538  [SO16]  70.01,151.37 180 top
IC31  78L10  [SOT89_ROUND]  77.76,147.43 0 top
IC32  LM2904  [SO08]  72.81,116.19 0 top
IC33  NUP4304SOT457_R  [SOT457R_PHILIPS]  89.32,143.88 90 top
IC34  4028  [SO16]  10.83,199.02 270 top
IC35  6V pos  [78LXX]  39.53,163.97 270 bottom
IC36  317TO202H_NOHOLE  [TO220H_NOHOLE]  50.84,201.05 0 bottom
IC37  ULN2004  [SO16]  11.23,180.48 270 top
IC38  LM339  [SO14]  51.47,169.3 270 top
IC39  78L06  [SOT89_ROUND]  43.72,162.7 270 top
IC40  555  [SO08]  69.12,194.06 180 top
IC41  4538  [SO16]  70.01,203.97 180 top
IC42  78L10  [SOT89_ROUND]  77.76,200.03 0 top
IC43  LM2904  [SO08]  72.81,168.79 0 top
IC44  NUP4304SOT457_R  [SOT457R_PHILIPS]  89.32,196.48 90 top
IC45  4028  [SO16]  10.83,251.62 270 top
IC46  6V pos  [78LXX]  39.53,216.57 270 bottom
IC47  317TO202H_NOHOLE  [TO220H_NOHOLE]  50.84,253.65 0 bottom
IC48  ULN2004  [SO16]  11.23,233.08 270 top
IC49  LM339  [SO14]  51.47,221.9 270 top
IC50  78L06  [SOT89_ROUND]  43.72,215.3 270 top
IC51  555  [SO08]  69.12,246.67 180 top
IC52  4538  [SO16]  70.01,256.57 180 top
IC53  78L10  [SOT89_ROUND]  77.76,252.63 0 top
IC54  LM2904  [SO08]  72.81,221.39 0 top
IC55  NUP4304SOT457_R  [SOT457R_PHILIPS]  89.32,249.08 90 top
IC56  4028  [SO16]  10.83,304.22 270 top
IC57  6V pos  [78LXX]  39.53,269.17 270 bottom
IC58  317TO202H_NOHOLE  [TO220H_NOHOLE]  50.84,306.25 0 bottom
IC59  ULN2004  [SO16]  11.23,285.68 270 top
IC60  LM339  [SO14]  51.47,274.5 270 top
IC61  78L06  [SOT89_ROUND]  43.72,267.9 270 top
IC62  555  [SO08]  69.12,299.26 180 top
IC63  4538  [SO16]  70.01,309.17 180 top
IC64  78L10  [SOT89_ROUND]  77.76,305.23 0 top
IC65  LM2904  [SO08]  72.81,273.99 0 top
IC66  NUP4304SOT457_R  [SOT457R_PHILIPS]  89.32,301.68 90 top
IC67  4028  [SO16]  106.83,41.22 270 top
IC68  6V pos  [78LXX]  135.53,6.17 270 bottom
IC69  317TO202H_NOHOLE  [TO220H_NOHOLE]  146.84,43.25 0 bottom
IC70  ULN2004  [SO16]  107.23,22.68 270 top
IC71  LM339  [SO14]  147.47,11.5 270 top
IC72  78L06  [SOT89_ROUND]  139.72,4.9 270 top
IC73  555  [SO08]  165.12,36.27 180 top
IC74  4538  [SO16]  166.01,46.17 180 top
IC75  78L10  [SOT89_ROUND]  173.76,42.23 0 top
IC76  LM2904  [SO08]  168.81,10.99 0 top
IC77  NUP4304SOT457_R  [SOT457R_PHILIPS]  185.32,38.68 90 top
IC78  4028  [SO16]  106.83,93.82 270 top
IC79  6V pos  [78LXX]  135.53,58.77 270 bottom
IC80  317TO202H_NOHOLE  [TO220H_NOHOLE]  146.84,95.85 0 bottom
IC81  ULN2004  [SO16]  107.23,75.28 270 top
IC82  LM339  [SO14]  147.47,64.1 270 top
IC83  78L06  [SOT89_ROUND]  139.72,57.5 270 top
IC84  555  [SO08]  165.12,88.86 180 top
IC85  4538  [SO16]  166.01,98.77 180 top
IC86  78L10  [SOT89_ROUND]  173.76,94.83 0 top
IC87  LM2904  [SO08]  168.81,63.59 0 top
IC88  NUP4304SOT457_R  [SOT457R_PHILIPS]  185.32,91.28 90 top
IC89  4028  [SO16]  106.83,146.42 270 top
IC90  6V pos  [78LXX]  135.53,111.37 270 bottom
IC91  317TO202H_NOHOLE  [TO220H_NOHOLE]  146.84,148.45 0 bottom
IC92  ULN2004  [SO16]  107.23,127.88 270 top
IC93  LM339  [SO14]  147.47,116.7 270 top
IC94  78L06  [SOT89_ROUND]  139.72,110.1 270 top
IC95  555  [SO08]  165.12,141.47 180 top
IC96  4538  [SO16]  166.01,151.37 180 top
IC97  78L10  [SOT89_ROUND]  173.76,147.43 0 top
IC98  LM2904  [SO08]  168.81,116.19 0 top
IC99  NUP4304SOT457_R  [SOT457R_PHILIPS]  185.32,143.88 90 top
IC100  4028  [SO16]  106.83,199.02 270 top
IC101  6V pos  [78LXX]  135.53,163.97 270 bottom
IC102  317TO202H_NOHOLE  [TO220H_NOHOLE]  146.84,201.05 0 bottom
IC103  ULN2004  [SO16]  107.23,180.48 270 top
IC104  LM339  [SO14]  147.47,169.3 270 top
IC105  78L06  [SOT89_ROUND]  139.72,162.7 270 top
IC106  555  [SO08]  165.12,194.06 180 top
IC107  4538  [SO16]  166.01,203.97 180 top
IC108  78L10  [SOT89_ROUND]  173.76,200.03 0 top
IC109  LM2904  [SO08]  168.81,168.79 0 top
IC110  NUP4304SOT457_R  [SOT457R_PHILIPS]  185.32,196.48 90 top
IC111  4028  [SO16]  106.83,251.62 270 top
IC112  6V pos  [78LXX]  135.53,216.57 270 bottom
IC113  317TO202H_NOHOLE  [TO220H_NOHOLE]  146.84,253.65 0 bottom
IC114  ULN2004  [SO16]  107.23,233.08 270 top
IC115  LM339  [SO14]  147.47,221.9 270 top
IC116  78L06  [SOT89_ROUND]  139.72,215.3 270 top
IC117  555  [SO08]  165.12,246.67 180 top
IC118  4538  [SO16]  166.01,256.57 180 top
IC119  78L10  [SOT89_ROUND]  173.76,252.63 0 top
IC120  LM2904  [SO08]  168.81,221.39 0 top
IC121  NUP4304SOT457_R  [SOT457R_PHILIPS]  185.32,249.08 90 top
IC122  4028  [SO16]  106.83,304.22 270 top
IC123  6V pos  [78LXX]  135.53,269.17 270 bottom
IC124  317TO202H_NOHOLE  [TO220H_NOHOLE]  146.84,306.25 0 bottom
IC125  ULN2004  [SO16]  107.23,285.68 270 top
IC126  LM339  [SO14]  147.47,274.5 270 top
IC127  78L06  [SOT89_ROUND]  139.72,267.9 270 top
IC128  555  [SO08]  165.12,299.26 180 top
IC129  4538  [SO16]  166.01,309.17 180 top
IC130  78L10  [SOT89_ROUND]  173.76,305.23 0 top
IC131  LM2904  [SO08]  168.81,273.99 0 top
IC132  NUP4304SOT457_R  [SOT457R_PHILIPS]  185.32,301.68 90 top
JP1  [JP2_SMALLPADS]  72.55,24.96 180 bottom
JP2  [JP2_SMALLPADS]  92.5,6.15 180 bottom
JP3  [JP2_SMALLPADS]  41.82,33.85 0 bottom
JP4  [JP2_SMALLPADS]  72.55,30.8 180 bottom
JP5  JP2E_ORIG  [JP2_ORIG_SMALLPADS]  72.55,20.14 180 bottom
JP6  [JP2_SMALLPADS]  72.55,77.56 180 bottom
JP7  JP2E_ORIG  [JP2_ORIG_SMALLPADS]  72.55,72.74 180 bottom
JP8  [JP2_SMALLPADS]  92.5,58.75 180 bottom
JP9  [JP2_SMALLPADS]  41.82,86.45 0 bottom
JP10  [JP2_SMALLPADS]  72.55,83.4 180 bottom
JP11  [JP2_SMALLPADS]  72.55,130.16 180 bottom
JP12  JP2E_ORIG  [JP2_ORIG_SMALLPADS]  72.55,125.34 180 bottom
JP13  [JP2_SMALLPADS]  92.5,111.35 180 bottom
JP14  [JP2_SMALLPADS]  41.82,139.05 0 bottom
JP15  [JP2_SMALLPADS]  72.55,136 180 bottom
JP16  [JP2_SMALLPADS]  72.55,182.76 180 bottom
JP17  JP2E_ORIG  [JP2_ORIG_SMALLPADS]  72.55,177.94 180 bottom
JP18  [JP2_SMALLPADS]  92.5,163.95 180 bottom
JP19  [JP2_SMALLPADS]  41.82,191.65 0 bottom
JP20  [JP2_SMALLPADS]  72.55,188.6 180 bottom
JP21  [JP2_SMALLPADS]  72.55,235.36 180 bottom
JP22  JP2E_ORIG  [JP2_ORIG_SMALLPADS]  72.55,230.54 180 bottom
JP23  [JP2_SMALLPADS]  92.5,216.55 180 bottom
JP24  [JP2_SMALLPADS]  41.82,244.25 0 bottom
JP25  [JP2_SMALLPADS]  72.55,241.2 180 bottom
JP26  [JP2_SMALLPADS]  72.55,287.96 180 bottom
JP27  JP2E_ORIG  [JP2_ORIG_SMALLPADS]  72.55,283.14 180 bottom
JP28  [JP2_SMALLPADS]  92.5,269.15 180 bottom
JP29  [JP2_SMALLPADS]  41.82,296.85 0 bottom
JP30  [JP2_SMALLPADS]  72.55,293.8 180 bottom
JP31  [JP2_SMALLPADS]  168.55,24.96 180 bottom
JP32  JP2E_ORIG  [JP2_ORIG_SMALLPADS]  168.55,20.14 180 bottom
JP33  [JP2_SMALLPADS]  188.5,6.15 180 bottom
JP34  [JP2_SMALLPADS]  137.82,33.85 0 bottom
JP35  [JP2_SMALLPADS]  168.55,30.8 180 bottom
JP36  [JP2_SMALLPADS]  168.55,77.56 180 bottom
JP37  JP2E_ORIG  [JP2_ORIG_SMALLPADS]  168.55,72.74 180 bottom
JP38  [JP2_SMALLPADS]  188.5,58.75 180 bottom
JP39  [JP2_SMALLPADS]  137.82,86.45 0 bottom
JP40  [JP2_SMALLPADS]  168.55,83.4 180 bottom
JP41  [JP2_SMALLPADS]  168.55,130.16 180 bottom
JP42  JP2E_ORIG  [JP2_ORIG_SMALLPADS]  168.55,125.34 180 bottom
JP43  [JP2_SMALLPADS]  188.5,111.35 180 bottom
JP44  [JP2_SMALLPADS]  137.82,139.05 0 bottom
JP45  [JP2_SMALLPADS]  168.55,136 180 bottom
JP46  [JP2_SMALLPADS]  168.55,182.76 180 bottom
JP47  JP2E_ORIG  [JP2_ORIG_SMALLPADS]  168.55,177.94 180 bottom
JP48  [JP2_SMALLPADS]  188.5,163.95 180 bottom
JP49  [JP2_SMALLPADS]  137.82,191.65 0 bottom
JP50  [JP2_SMALLPADS]  168.55,188.6 180 bottom
JP51  [JP2_SMALLPADS]  168.55,235.36 180 bottom
JP52  JP2E_ORIG  [JP2_ORIG_SMALLPADS]  168.55,230.54 180 bottom
JP53  [JP2_SMALLPADS]  188.5,216.55 180 bottom
JP54  [JP2_SMALLPADS]  137.82,244.25 0 bottom
JP55  [JP2_SMALLPADS]  168.55,241.2 180 bottom
JP56  [JP2_SMALLPADS]  168.55,287.96 180 bottom
JP57  JP2E_ORIG  [JP2_ORIG_SMALLPADS]  168.55,283.14 180 bottom
JP58  [JP2_SMALLPADS]  188.5,269.15 180 bottom
JP59  [JP2_SMALLPADS]  137.82,296.85 0 bottom
JP60  [JP2_SMALLPADS]  168.55,293.8 180 bottom
LED1  [LD260]  39.28,28.05 0 bottom
LED2  [LD260]  39.28,10.55 0 bottom
LED3  [LD260]  39.28,14.05 0 bottom
LED4  [LD260]  39.28,17.55 0 bottom
LED5  [LD260]  39.28,21.05 0 bottom
LED6  [LD260]  39.28,31.42 0 bottom
LED7  [LD260]  39.28,63.15 0 bottom
LED8  [LD260]  39.28,66.65 0 bottom
LED9  [LD260]  39.28,70.15 0 bottom
LED10  [LD260]  39.28,73.65 0 bottom
LED11  [LD260]  39.28,80.65 0 bottom
LED12  [LD260]  39.28,84.02 0 bottom
LED13  [LD260]  39.28,115.75 0 bottom
LED14  [LD260]  39.28,119.25 0 bottom
LED15  [LD260]  39.28,122.75 0 bottom
LED16  [LD260]  39.28,126.25 0 bottom
LED17  [LD260]  39.28,133.25 0 bottom
LED18  [LD260]  39.28,136.62 0 bottom
LED19  [LD260]  39.28,168.35 0 bottom
LED20  [LD260]  39.28,171.85 0 bottom
LED21  [LD260]  39.28,175.35 0 bottom
LED22  [LD260]  39.28,178.85 0 bottom
LED23  [LD260]  39.28,185.85 0 bottom
LED24  [LD260]  39.28,189.22 0 bottom
LED25  [LD260]  39.28,220.95 0 bottom
LED26  [LD260]  39.28,224.45 0 bottom
LED27  [LD260]  39.28,227.95 0 bottom
LED28  [LD260]  39.28,231.45 0 bottom
LED29  [LD260]  39.28,238.45 0 bottom
LED30  [LD260]  39.28,241.82 0 bottom
LED31  [LD260]  39.28,273.55 0 bottom
LED32  [LD260]  39.28,277.05 0 bottom
LED33  [LD260]  39.28,280.55 0 bottom
LED34  [LD260]  39.28,284.05 0 bottom
LED35  [LD260]  39.28,291.05 0 bottom
LED36  [LD260]  39.28,294.42 0 bottom
LED37  [LD260]  135.28,10.55 0 bottom
LED38  [LD260]  135.28,14.05 0 bottom
LED39  [LD260]  135.28,17.55 0 bottom
LED40  [LD260]  135.28,21.05 0 bottom
LED41  [LD260]  135.28,28.05 0 bottom
LED42  [LD260]  135.28,31.42 0 bottom
LED43  [LD260]  135.28,63.15 0 bottom
LED44  [LD260]  135.28,66.65 0 bottom
LED45  [LD260]  135.28,70.15 0 bottom
LED46  [LD260]  135.28,73.65 0 bottom
LED47  [LD260]  135.28,80.65 0 bottom
LED48  [LD260]  135.28,84.02 0 bottom
LED49  [LD260]  135.28,115.75 0 bottom
LED50  [LD260]  135.28,119.25 0 bottom
LED51  [LD260]  135.28,122.75 0 bottom
LED52  [LD260]  135.28,126.25 0 bottom
LED53  [LD260]  135.28,133.25 0 bottom
LED54  [LD260]  135.28,136.62 0 bottom
LED55  [LD260]  135.28,168.35 0 bottom
LED56  [LD260]  135.28,171.85 0 bottom
LED57  [LD260]  135.28,175.35 0 bottom
LED58  [LD260]  135.28,178.85 0 bottom
LED59  [LD260]  135.28,185.85 0 bottom
LED60  [LD260]  135.28,189.22 0 bottom
LED61  [LD260]  135.28,220.95 0 bottom
LED62  [LD260]  135.28,224.45 0 bottom
LED63  [LD260]  135.28,227.95 0 bottom
LED64  [LD260]  135.28,231.45 0 bottom
LED65  [LD260]  135.28,238.45 0 bottom
LED66  [LD260]  135.28,241.82 0 bottom
LED67  [LD260]  135.28,273.55 0 bottom
LED68  [LD260]  135.28,277.05 0 bottom
LED69  [LD260]  135.28,280.55 0 bottom
LED70  [LD260]  135.28,284.05 0 bottom
LED71  [LD260]  135.28,291.05 0 bottom
LED72  [LD260]  135.28,294.42 0 bottom
Q1  BA.  [SOT89]  28.1,3.88 90 top
Q2  BA.  [SOT89]  15.15,4.13 90 top
Q3  MY  [SOT89]  66.46,16.2 180 top
Q4  BA  [SOT89]  93.76,22.17 90 top
Q5  BA  [SOT89]  49.18,44.01 90 top
Q6  J1  [SOT-23]  14.26,31.82 270 top
Q7  J1  [SOT-23]  79.28,18.48 270 top
Q8  BA  [SOT89]  93.76,74.77 90 top
Q9  BA.  [SOT89]  15.15,56.73 90 top
Q10  BA.  [SOT89]  28.1,56.48 90 top
Q11  BA  [SOT89]  49.18,96.61 90 top
Q12  MY  [SOT89]  66.46,68.8 180 top
Q13  J1  [SOT-23]  79.28,71.08 270 top
Q14  J1  [SOT-23]  14.26,84.42 270 top
Q15  BA  [SOT89]  93.76,127.37 90 top
Q16  BA.  [SOT89]  15.15,109.33 90 top
Q17  BA.  [SOT89]  28.1,109.08 90 top
Q18  BA  [SOT89]  49.18,149.21 90 top
Q19  MY  [SOT89]  66.46,121.4 180 top
Q20  J1  [SOT-23]  79.28,123.69 270 top
Q21  J1  [SOT-23]  14.26,137.02 270 top
Q22  BA  [SOT89]  93.76,179.97 90 top
Q23  BA.  [SOT89]  15.15,161.93 90 top
Q24  BA.  [SOT89]  28.1,161.68 90 top
Q25  BA  [SOT89]  49.18,201.81 90 top
Q26  MY  [SOT89]  66.46,174 180 top
Q27  J1  [SOT-23]  79.28,176.29 270 top
Q28  J1  [SOT-23]  14.26,189.62 270 top
Q29  BA  [SOT89]  93.76,232.57 90 top
Q30  BA.  [SOT89]  15.15,214.53 90 top
Q31  BA.  [SOT89]  28.1,214.28 90 top
Q32  BA  [SOT89]  49.18,254.41 90 top
Q33  MY  [SOT89]  66.46,226.6 180 top
Q34  J1  [SOT-23]  79.28,228.89 270 top
Q35  J1  [SOT-23]  14.26,242.22 270 top
Q36  BA  [SOT89]  93.76,285.17 90 top
Q37  BA.  [SOT89]  15.15,267.13 90 top
Q38  BA.  [SOT89]  28.1,266.88 90 top
Q39  BA  [SOT89]  49.18,307.01 90 top
Q40  MY  [SOT89]  66.46,279.2 180 top
Q41  J1  [SOT-23]  79.28,281.49 270 top
Q42  J1  [SOT-23]  14.26,294.82 270 top
Q43  BA  [SOT89]  189.76,22.17 90 top
Q44  BA.  [SOT89]  111.15,4.13 90 top
Q45  BA.  [SOT89]  124.1,3.88 90 top
Q46  BA  [SOT89]  145.18,44.01 90 top
Q47  MY  [SOT89]  162.46,16.2 180 top
Q48  J1  [SOT-23]  175.28,18.48 270 top
Q49  J1  [SOT-23]  110.26,31.82 270 top
Q50  BA  [SOT89]  189.76,74.77 90 top
Q51  BA.  [SOT89]  111.15,56.73 90 top
Q52  BA.  [SOT89]  124.1,56.48 90 top
Q53  BA  [SOT89]  145.18,96.61 90 top
Q54  MY  [SOT89]  162.46,68.8 180 top
Q55  J1  [SOT-23]  175.28,71.08 270 top
Q56  J1  [SOT-23]  110.26,84.42 270 top
Q57  BA  [SOT89]  189.76,127.37 90 top
Q58  BA.  [SOT89]  111.15,109.33 90 top
Q59  BA.  [SOT89]  124.1,109.08 90 top
Q60  BA  [SOT89]  145.18,149.21 90 top
Q61  MY  [SOT89]  162.46,121.4 180 top
Q62  J1  [SOT-23]  175.28,123.69 270 top
Q63  J1  [SOT-23]  110.26,137.02 270 top
Q64  BA  [SOT89]  189.76,179.97 90 top
Q65  BA.  [SOT89]  111.15,161.93 90 top
Q66  BA.  [SOT89]  124.1,161.68 90 top
Q67  BA  [SOT89]  145.18,201.81 90 top
Q68  MY  [SOT89]  162.46,174 180 top
Q69  J1  [SOT-23]  175.28,176.29 270 top
Q70  J1  [SOT-23]  110.26,189.62 270 top
Q71  BA  [SOT89]  189.76,232.57 90 top
Q72  BA.  [SOT89]  111.15,214.53 90 top
Q73  BA.  [SOT89]  124.1,214.28 90 top
Q74  BA  [SOT89]  145.18,254.41 90 top
Q75  MY  [SOT89]  162.46,226.6 180 top
Q76  J1  [SOT-23]  175.28,228.89 270 top
Q77  J1  [SOT-23]  110.26,242.22 270 top
Q78  BA  [SOT89]  189.76,285.17 90 top
Q79  BA.  [SOT89]  111.15,267.13 90 top
Q80  BA.  [SOT89]  124.1,266.88 90 top
Q81  BA  [SOT89]  145.18,307.01 90 top
Q82  MY  [SOT89]  162.46,279.2 180 top
Q83  J1  [SOT-23]  175.28,281.49 270 top
Q84  J1  [SOT-23]  110.26,294.82 270 top
R1  102  [R0805]  8.16,8.83 270 top
R2  13  [R1206]  22.51,9.72 180 top
R3  R_user  [R0805']  12.87,13.79 180 top
R4  R_user  [R0805']  8.67,9.6 270 bottom
R5  4701  [R0805]  67.73,4.39 270 top
R6  13  [R1206]  18.96,14.04 180 top
R7  1002  [R0805]  72.3,4.39 90 top
R8  1002  [R0805]  77.89,10.48 270 top
R9  104  [R0805]  95.03,43.5 90 top
R10  104  [R0805]  95.03,40.2 90 top
R11  104  [R0805]  95.03,36.9 90 top
R12  102  [R0805]  77.89,13.53 270 top
R13  102  [R0805]  67.47,10.48 90 top
R14  102  [R0805]  67.47,7.44 90 top
R15  100  [R0805]  57.31,14.8 0 top
R16  4701  [R0805]  71.28,16.58 270 top
R17  2702  [R0805]  75.35,16.58 90 top
R18  13  [R1206]  66.21,21.66 180 top
R19  2201  [R0805]  66.2,24.96 90 top
R20  1002  [R0805]  53.5,29.15 180 top
R21  1502  [R0805]  48.8,3.63 0 top
R22  2702  [R0805]  51.34,3.63 0 top
R23  2702  [R0805]  56.68,3.63 180 top
R24  1002  [R0805]  49.25,18.04 270 top
R25  104  [R0805]  47.85,20.26 270 top
R26  4701  [R0805]  54.52,24.33 0 top
R27  47  [V235/17_1MM]  97.95,18.61 90 bottom
R28  102  [R0805]  88.68,18.87 90 top
R29  47  [V235/17_1MM]  97.95,38.49 90 bottom
R30  104  [R0805]  52.55,20.26 270 top
R31  1502  [R0805]  45.5,12.26 180 top
R32  1002  [R0805]  42.83,13.6 180 top
R33  2201  [R0805]  42.83,18.17 0 top
R34  13  [R1206]  52.1,37.66 180 top
R35  104  [R0805]  74.33,22.55 270 top
R36  47  [V235/17_1MM]  92.36,19.12 90 bottom
R37  47  [V235/17_1MM]  92.36,39 270 bottom
R38  100  [R0805]  78.78,21.91 90 top
R39  (101)  [R0805]  78.78,25.09 90 top
R40  2702  [R0805]  67.22,30.68 270 top
R41  104  [R0805]  78.14,35.63 270 top
R42  (1000)  [R0805]  42.83,8.96 0 top
R43  (101)  [R0805]  33.31,25.09 270 top
R44  (1002)  [R0805]  65.57,39.57 0 top
R45  2702  [R0805]  74.58,37.41 270 top
R46  (1002)  [R0805]  32.8,48.84 90 top
R47  47  [V235/17_1MM]  97.95,71.21 90 bottom
R48  13  [R1206]  52.1,90.26 180 top
R49  47  [V235/17_1MM]  97.95,91.09 90 bottom
R50  104  [R0805]  95.03,96.1 90 top
R51  104  [R0805]  95.03,92.8 90 top
R52  104  [R0805]  95.03,89.5 90 top
R53  4701  [R0805]  67.73,56.99 270 top
R54  1002  [R0805]  72.3,56.99 90 top
R55  1002  [R0805]  53.5,81.75 180 top
R56  1502  [R0805]  48.8,56.23 0 top
R57  104  [R0805]  47.85,72.86 270 top
R58  104  [R0805]  52.55,72.86 270 top
R59  1502  [R0805]  45.5,64.86 180 top
R60  1002  [R0805]  42.83,66.2 180 top
R61  2201  [R0805]  42.83,70.77 0 top
R62  1002  [R0805]  49.25,70.64 270 top
R63  4701  [R0805]  54.52,76.93 0 top
R64  2702  [R0805]  56.68,56.23 180 top
R65  102  [R0805]  8.16,61.43 270 top
R66  R_user  [R0805']  8.67,62.2 270 bottom
R67  100  [R0805]  57.31,67.4 0 top
R68  (101)  [R0805]  33.31,77.69 270 top
R69  (1000)  [R0805]  42.83,61.56 0 top
R70  102  [R0805]  88.68,71.47 90 top
R71  13  [R1206]  18.96,66.64 180 top
R72  13  [R1206]  22.51,62.32 180 top
R73  2702  [R0805]  51.34,56.23 0 top
R74  4701  [R0805]  71.28,69.18 270 top
R75  100  [R0805]  78.78,74.51 90 top
R76  (101)  [R0805]  78.78,77.69 90 top
R77  104  [R0805]  74.33,75.15 270 top
R78  104  [R0805]  78.14,88.23 270 top
R79  (1002)  [R0805]  65.57,92.17 0 top
R80  2702  [R0805]  67.22,83.28 270 top
R81  47  [V235/17_1MM]  92.36,71.72 90 bottom
R82  47  [V235/17_1MM]  92.36,91.6 270 bottom
R83  2702  [R0805]  74.58,90.01 270 top
R84  2201  [R0805]  66.2,77.56 90 top
R85  (1002)  [R0805]  32.8,101.44 90 top
R86  1002  [R0805]  77.89,63.08 270 top
R87  102  [R0805]  77.89,66.13 270 top
R88  2702  [R0805]  75.35,69.18 90 top
R89  102  [R0805]  67.47,63.08 90 top
R90  102  [R0805]  67.47,60.04 90 top
R91  13  [R1206]  66.21,74.26 180 top
R92  R_user  [R0805']  12.87,66.39 180 top
R93  47  [V235/17_1MM]  97.95,123.81 90 bottom
R94  13  [R1206]  52.1,142.86 180 top
R95  47  [V235/17_1MM]  97.95,143.69 90 bottom
R96  104  [R0805]  95.03,148.7 90 top
R97  104  [R0805]  95.03,145.4 90 top
R98  104  [R0805]  95.03,142.1 90 top
R99  4701  [R0805]  67.73,109.59 270 top
R100  1002  [R0805]  72.3,109.59 90 top
R101  1002  [R0805]  53.5,134.35 180 top
R102  1502  [R0805]  48.8,108.83 0 top
R103  104  [R0805]  47.85,125.46 270 top
R104  104  [R0805]  52.55,125.46 270 top
R105  1502  [R0805]  45.5,117.46 180 top
R106  1002  [R0805]  42.83,118.8 180 top
R107  2201  [R0805]  42.83,123.37 0 top
R108  1002  [R0805]  49.25,123.24 270 top
R109  4701  [R0805]  54.52,129.53 0 top
R110  2702  [R0805]  56.68,108.83 180 top
R111  102  [R0805]  8.16,114.03 270 top
R112  R_user  [R0805']  8.67,114.8 270 bottom
R113  100  [R0805]  57.31,120 0 top
R114  (101)  [R0805]  33.31,130.29 270 top
R115  (1000)  [R0805]  42.83,114.16 0 top
R116  102  [R0805]  88.68,124.07 90 top
R117  13  [R1206]  18.96,119.24 180 top
R118  13  [R1206]  22.51,114.92 180 top
R119  2702  [R0805]  51.34,108.83 0 top
R120  4701  [R0805]  71.28,121.78 270 top
R121  100  [R0805]  78.78,127.11 90 top
R122  (101)  [R0805]  78.78,130.29 90 top
R123  104  [R0805]  74.33,127.75 270 top
R124  104  [R0805]  78.14,140.83 270 top
R125  (1002)  [R0805]  65.57,144.77 0 top
R126  2702  [R0805]  67.22,135.88 270 top
R127  47  [V235/17_1MM]  92.36,124.32 90 bottom
R128  47  [V235/17_1MM]  92.36,144.2 270 bottom
R129  2702  [R0805]  74.58,142.61 270 top
R130  2201  [R0805]  66.2,130.16 90 top
R131  (1002)  [R0805]  32.8,154.04 90 top
R132  1002  [R0805]  77.89,115.68 270 top
R133  102  [R0805]  77.89,118.73 270 top
R134  2702  [R0805]  75.35,121.78 90 top
R135  102  [R0805]  67.47,115.68 90 top
R136  102  [R0805]  67.47,112.64 90 top
R137  13  [R1206]  66.21,126.86 180 top
R138  R_user  [R0805']  12.87,118.99 180 top
R139  47  [V235/17_1MM]  97.95,176.41 90 bottom
R140  13  [R1206]  52.1,195.46 180 top
R141  47  [V235/17_1MM]  97.95,196.29 90 bottom
R142  104  [R0805]  95.03,201.3 90 top
R143  104  [R0805]  95.03,198 90 top
R144  104  [R0805]  95.03,194.7 90 top
R145  4701  [R0805]  67.73,162.19 270 top
R146  1002  [R0805]  72.3,162.19 90 top
R147  1002  [R0805]  53.5,186.95 180 top
R148  1502  [R0805]  48.8,161.43 0 top
R149  104  [R0805]  47.85,178.06 270 top
R150  104  [R0805]  52.55,178.06 270 top
R151  1502  [R0805]  45.5,170.06 180 top
R152  1002  [R0805]  42.83,171.4 180 top
R153  2201  [R0805]  42.83,175.97 0 top
R154  1002  [R0805]  49.25,175.84 270 top
R155  4701  [R0805]  54.52,182.13 0 top
R156  2702  [R0805]  56.68,161.43 180 top
R157  102  [R0805]  8.16,166.63 270 top
R158  R_user  [R0805']  8.67,167.4 270 bottom
R159  100  [R0805]  57.31,172.6 0 top
R160  (101)  [R0805]  33.31,182.89 270 top
R161  (1000)  [R0805]  42.83,166.76 0 top
R162  102  [R0805]  88.68,176.67 90 top
R163  13  [R1206]  18.96,171.84 180 top
R164  13  [R1206]  22.51,167.52 180 top
R165  2702  [R0805]  51.34,161.43 0 top
R166  4701  [R0805]  71.28,174.38 270 top
R167  100  [R0805]  78.78,179.71 90 top
R168  (101)  [R0805]  78.78,182.89 90 top
R169  104  [R0805]  74.33,180.35 270 top
R170  104  [R0805]  78.14,193.43 270 top
R171  (1002)  [R0805]  65.57,197.37 0 top
R172  2702  [R0805]  67.22,188.48 270 top
R173  47  [V235/17_1MM]  92.36,176.92 90 bottom
R174  47  [V235/17_1MM]  92.36,196.8 270 bottom
R175  2702  [R0805]  74.58,195.21 270 top
R176  2201  [R0805]  66.2,182.76 90 top
R177  (1002)  [R0805]  32.8,206.64 90 top
R178  1002  [R0805]  77.89,168.28 270 top
R179  102  [R0805]  77.89,171.33 270 top
R180  2702  [R0805]  75.35,174.38 90 top
R181  102  [R0805]  67.47,168.28 90 top
R182  102  [R0805]  67.47,165.24 90 top
R183  13  [R1206]  66.21,179.46 180 top
R184  R_user  [R0805']  12.87,171.59 180 top
R185  47  [V235/17_1MM]  97.95,229.01 90 bottom
R186  13  [R1206]  52.1,248.06 180 top
R187  47  [V235/17_1MM]  97.95,248.89 90 bottom
R188  104  [R0805]  95.03,253.9 90 top
R189  104  [R0805]  95.03,250.6 90 top
R190  104  [R0805]  95.03,247.3 90 top
R191  4701  [R0805]  67.73,214.79 270 top
R192  1002  [R0805]  72.3,214.79 90 top
R193  1002  [R0805]  53.5,239.55 180 top
R194  1502  [R0805]  48.8,214.03 0 top
R195  104  [R0805]  47.85,230.66 270 top
R196  104  [R0805]  52.55,230.66 270 top
R197  1502  [R0805]  45.5,222.66 180 top
R198  1002  [R0805]  42.83,224 180 top
R199  2201  [R0805]  42.83,228.57 0 top
R200  1002  [R0805]  49.25,228.44 270 top
R201  4701  [R0805]  54.52,234.73 0 top
R202  2702  [R0805]  56.68,214.03 180 top
R203  102  [R0805]  8.16,219.23 270 top
R204  R_user  [R0805']  8.67,220 270 bottom
R205  100  [R0805]  57.31,225.2 0 top
R206  (101)  [R0805]  33.31,235.49 270 top
R207  (1000)  [R0805]  42.83,219.36 0 top
R208  102  [R0805]  88.68,229.27 90 top
R209  13  [R1206]  18.96,224.44 180 top
R210  13  [R1206]  22.51,220.12 180 top
R211  2702  [R0805]  51.34,214.03 0 top
R212  4701  [R0805]  71.28,226.98 270 top
R213  100  [R0805]  78.78,232.31 90 top
R214  (101)  [R0805]  78.78,235.49 90 top
R215  104  [R0805]  74.33,232.95 270 top
R216  104  [R0805]  78.14,246.03 270 top
R217  (1002)  [R0805]  65.57,249.97 0 top
R218  2702  [R0805]  67.22,241.08 270 top
R219  47  [V235/17_1MM]  92.36,229.52 90 bottom
R220  47  [V235/17_1MM]  92.36,249.4 270 bottom
R221  2702  [R0805]  74.58,247.81 270 top
R222  2201  [R0805]  66.2,235.36 90 top
R223  (1002)  [R0805]  32.8,259.24 90 top
R224  1002  [R0805]  77.89,220.88 270 top
R225  102  [R0805]  77.89,223.93 270 top
R226  2702  [R0805]  75.35,226.98 90 top
R227  102  [R0805]  67.47,220.88 90 top
R228  102  [R0805]  67.47,217.84 90 top
R229  13  [R1206]  66.21,232.06 180 top
R230  R_user  [R0805']  12.87,224.19 180 top
R231  47  [V235/17_1MM]  97.95,281.61 90 bottom